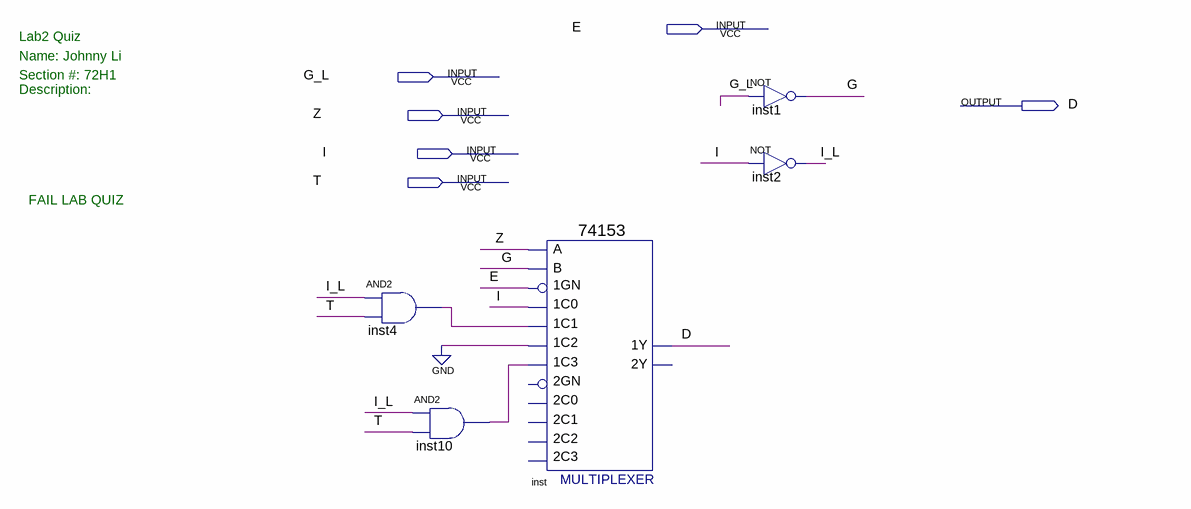
[diagram p0: schematic sheet]
// Quartus schematic lab2quiz.bdf as structural Verilog: 5 symbols, 6 pins
module lab2quiz (
  input  E,
  input  G_L,
  input  Z,
  input  I,
  input  T,
  output D
);

  wire G, I_L, inst4_out, inst10_out;

  and inst4 (inst4_out, I_L, T);
  and inst10 (inst10_out, I_L, T);
  \74153  inst (
    .\1C1 (inst4_out), .\1GN (E), .\1C0 (I), .\1C2 (1'b0), .\1C3 (inst10_out), .B(G), .A(Z), .\1Y (D));  // open: 2C0, 2GN, 2C2, 2C1, 2C3, 2Y
  not inst1 (G, G_L);
  not inst2 (I_L, I);

  // Notes on the sheet:
  //   Lab2 Quiz
  //   Name: Johnny Li
  //   Section #: 72H1
  //   Description: 
  //   FAIL LAB QUIZ
endmodule
